# Altium schematic sheet Mini-Coil - Power Board.SchDoc
size A3; SheetNumber: 1; SheetTotal: 1
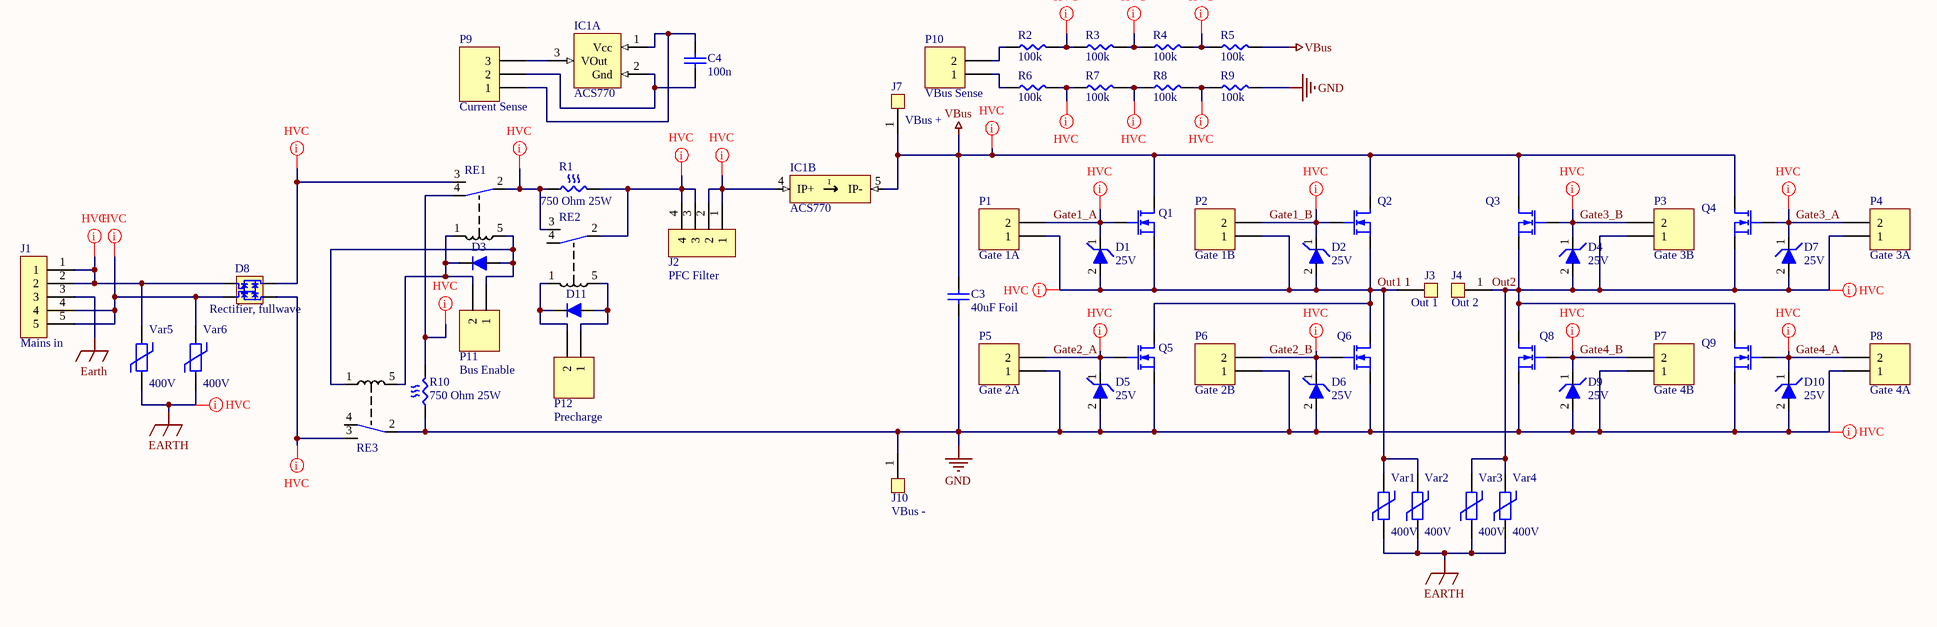
[diagram p0: Mini-Coil - Power Board.SchDoc]

## Parts
C3  40uF Foil  [B32778G Film Cap]
C4  100n  [0603]
D1  25V  [DO-214]
D2  25V  [DO-214]
D3  Diode  [DO-214]  (value not drawn)
D4  25V  [DO-214]
D5  25V  [DO-214]
D6  25V  [DO-214]
D7  25V  [DO-214]
D8  Rectifier, fullwave  [GBJ Rectifier right angle]
D9  25V  [DO-214]
D10  25V  [DO-214]
D11  Diode  [DO-214]  (value not drawn)
IC1  ACS770  [ACS770]  (parts A,B of 2)
J1  Mains in  [5 screw terminal]
J2  PFC Filter  [4 screw terminal]
J3  Out 1  [74655095R]
J4  Out 2  [74655095R]
J7  VBus +  [74651195R]
J10  VBus -  [74651195R]
P1  Gate 1A  [HDR1X2]
P2  Gate 1B  [HDR1X2]
P3  Gate 3B  [HDR1X2]
P4  Gate 3A  [HDR1X2]
P5  Gate 2A  [HDR1X2]
P6  Gate 2B  [HDR1X2]
P7  Gate 4B  [HDR1X2]
P8  Gate 4A  [HDR1X2]
P9  Current Sense  [HDR1X3]
P10  VBus Sense  [HDR1X2]
P11  Bus Enable  [HDR1X2]
P12  Precharge  [HDR1X2]
Q1  MOSFET  [TO247 Right Angle Side Mount]  (value not drawn)
Q2  MOSFET  [TO247 Right Angle Side Mount]  (value not drawn)
Q3  MOSFET  [TO247 Right Angle Side Mount]  (value not drawn)
Q4  MOSFET  [TO247 Right Angle Side Mount]  (value not drawn)
Q5  MOSFET  [TO247 Right Angle Side Mount]  (value not drawn)
Q6  MOSFET  [TO247 Right Angle Side Mount]  (value not drawn)
Q8  MOSFET  [TO247 Right Angle Side Mount]  (value not drawn)
Q9  MOSFET  [TO247 Right Angle Side Mount]  (value not drawn)
R1  750 Ohm 25W  [Ohmite 270-L25]
R2  100k  [0207 THT]
R3  100k  [0207 THT]
R4  100k  [0207 THT]
R5  100k  [0207 THT]
R6  100k  [0207 THT]
R7  100k  [0207 THT]
R8  100k  [0207 THT]
R9  100k  [0207 THT]
R10  750 Ohm 25W  [Ohmite 270-L25]
RE1  Relay DPDT  [Relay SPDT]  (value not drawn)
RE2  Relay DPDT  [Relay SPDT]  (value not drawn)
RE3  Relay DPDT  [Relay SPDT]  (value not drawn)
Var1  400V  [Varistor disc 7mm]
Var2  400V  [Varistor disc 7mm]
Var3  400V  [Varistor disc 7mm]
Var4  400V  [Varistor disc 7mm]
Var5  400V  [Varistor disc 7mm]
Var6  400V  [Varistor disc 7mm]

## Nets
Earth: J1.3 Var1.1 Var2.1 Var3.1 Var4.1 Var5.1 Var6.1
GND: C3.1 D5.2 D6.2 D9.2 D10.2 J10.1(O) P5.1 P6.1 P7.1 P8.1 Q5.S Q6.S Q8.S Q9.S R9.2 R10.1 RE3.2
VBus: C3.2 IC1.5(IP-) J7.1(O) Q1.D Q2.D Q3.D Q4.D R5.2
Gate1_A: D1.1 P1.2 Q1.G
Gate1_B: D2.1 P2.2 Q2.G
Gate2_A: D5.1 P5.2 Q5.G
Gate2_B: D6.1 P6.2 Q6.G
Gate3_A: D7.1 P4.2 Q4.G
Gate3_B: D4.1 P3.2 Q3.G
Gate4_A: D10.1 P8.2 Q9.G
Gate4_B: D9.1 P7.2 Q8.G
Out1: D1.2 D2.2 J3.1(O) P1.1 P2.1 Q1.S Q2.S Q5.D Q6.D Var1.2 Var2.2
Out2: D4.2 D7.2 J4.1(O) P3.1 P4.1 Q3.S Q4.S Q8.D Q9.D Var3.2 Var4.2
NetC4_1: C4.1 IC1.2(Gnd) P9.2
NetC4_2: C4.2 IC1.1(Vcc) P9.1
NetD3_1: D3.1 P11.1 RE1.5 RE3.1
NetD3_2: D3.2 P11.2 RE1.1 RE3.5
NetD8_1: D8.1 RE1.3
NetD8_2: D8.2 J1.1 J1.2 Var5.2
NetD8_3: D8.3 J1.4 J1.5 Var6.2
NetD8_4: D8.4 RE3.3
NetD11_1: D11.1 P12.1 RE2.5
NetD11_2: D11.2 P12.2 RE2.1
NetIC1_3: IC1.3(VOut) P9.3
NetIC1_4: IC1.4(IP+) J2.1 J2.2
NetJ2_3: J2.3 J2.4 R1.2 RE2.2
NetP10_1: P10.1 R6.1
NetP10_2: P10.2 R2.1
NetR1_1: R1.1 RE1.2 RE2.3
NetR2_2: R2.2 R3.1
NetR3_2: R3.2 R4.1
NetR4_2: R4.2 R5.1
NetR6_2: R6.2 R7.1
NetR7_2: R7.2 R8.1
NetR8_2: R8.2 R9.1
NetR10_2: R10.2 RE1.4

Not connected (* = marked no-connect by the designer): RE2 4(7); RE3 4(7)

## Layout directives
net class HV_G1: Gate1_A, Gate1_B, Out1
net class VBus: NetIC1_4, NetJ2_3, VBus
net class HV_G3: Gate3_A, Gate3_B, Out2
net class HV_GENERAL: NetD8_1, NetD8_2, NetD8_3, NetD8_4, NetR1_1, NetR10_2
net class R1; net class HV_GENERAL: NetR4_2
net class R3; net class HV_GENERAL: NetR2_2
net class R4; net class HV_GENERAL: NetR8_2
net class R5; net class HV_GENERAL: NetR7_2
net class R6; net class HV_GENERAL: NetR6_2
net class R2; net class HV_GENERAL: NetR3_2
net class HV_GND: Gate2_A, Gate2_B, Gate4_A, Gate4_B, GND
rule Clearance Constraint [Generic clearance = 1.5mm, and 18 value(s) for objects]: Earth

## Notes on the sheet
- (in symbol ACS770, part B) I

## Library data of the parts
C3 C4 = Cap
D1 D2 D4-D7 D9 D10 = TVS Diode: Supplier 1: Digi-Key; Supplier Part Number 1: UCLAMP3301HCT-ND
D3 D11 = Diode: Cmon its a diode what more do I need to say?; pin to pad: 1>2 2>1; Supplier 1: Digi-Key; Supplier Part Number 1: MBR10100GOS-ND; Supplier 2: Digi-Key; Supplier Part Number 2: 1655-1504-1-ND
IC1 = ACS770: Hall Effect Current Sensor; Supplier 1: Digi-Key; Supplier Part Number 1: 620-1792-1-ND
J1 = 5 screw terminal
J2 = 4 screw terminal
J3 J4 J7 J10 = Binding Post 1 Pin: Name: name; Supplier 1: Digi-Key; Supplier Part Number 1: 36-575-8-ND
P1-P8 P10-P12 = Header 2: Header, 2-Pin; LatestRevisionDate: 17-Jul-2002; LatestRevisionNote: Re-released for DXP Platform.; Publisher: Altium Limited
P9 = Header 3: Header, 3-Pin; LatestRevisionDate: 17-Jul-2002; LatestRevisionNote: Re-released for DXP Platform.; Publisher: Altium Limited
Q1-Q6 Q8 Q9 = Mosfet N: pin to pad: D>2 G>1 S>3; Supplier 1: Digi-Key; Supplier Part Number 1: 1727-5305-1-ND; Supplier 2: Digi-Key; Supplier Part Number 2: 1727-1123-1-ND; Supplier 3: Digi-Key; Supplier 4: Digi-Key; Supplier Part Number 4: T2N7002AKLMCT-ND; Supplier Part Number 3: BSC0906NSATMA1CT-ND; Supplier 5: Digi-Key; Supplier Part Number 5: 1727-4714-1-ND; Supplier 6: Digi-Key; Supplier 7: Digi-Key; Supplier Part Number 6: 497-14572-5-ND; Supplier Part Number 7: IPP180N10N3GXKSA1-ND
R1 R10 = Resistor Power: Rule: UNIONINDEX=0|RULEKIND=PolygonConnect|NETSCOPE=AnyNet|LAYERKIND=SameLayer|NAME=Schematic Polygon Connect Style|CONNECTSTYLE=Relief|RELIEFCONDUCTORWIDTH=25mil|RELIEFENTRIES=4|POLYGONRELIEFANGLE=45 Angle|AIRGAPWIDTH=10mil|UNIT=Imperial
R2-R9 = Resistor
RE1-RE3 = Relay SPDT: pin to pad: 1>4 2>1 4>2; Supplier 1: Digi-Key; Supplier Part Number 1: PB1193-ND
Var1-Var6 = Varistor: Varistor, he protecc